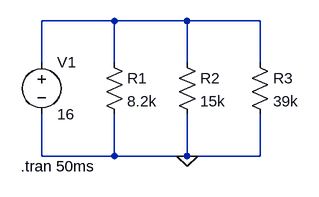
[diagram p0: schematic Draft3.asc]
Draft3.asc, the LTspice schematic file:
Version 4
SHEET 1 880 680
WIRE 112 80 0 80
WIRE 224 80 112 80
WIRE 336 80 224 80
WIRE 0 144 0 80
WIRE 112 144 112 80
WIRE 224 144 224 80
WIRE 336 144 336 80
WIRE 0 288 0 224
WIRE 112 288 112 224
WIRE 112 288 0 288
WIRE 224 288 224 224
WIRE 224 288 112 288
WIRE 336 288 336 224
WIRE 336 288 224 288
FLAG 224 288 0
SYMBOL res 96 128 R0
SYMATTR InstName R1
SYMATTR Value 8.2k
SYMBOL res 208 128 R0
SYMATTR InstName R2
SYMATTR Value 15k
SYMBOL res 320 128 R0
SYMATTR InstName R3
SYMATTR Value 39k
SYMBOL voltage 0 128 R0
WINDOW 123 0 0 Left 0
WINDOW 39 0 0 Left 0
SYMATTR InstName V1
SYMATTR Value 16
TEXT -32 304 Left 2 !.tran 50ms

The netlist it stands for:
* Draft3.asc
R1 N001 0 8.2k
R2 N001 0 15k
R3 N001 0 39k
V1 N001 0 16
.tran 50ms
.backanno
.end

* Results of the author's LTspice run, read from the files saved beside the schematic
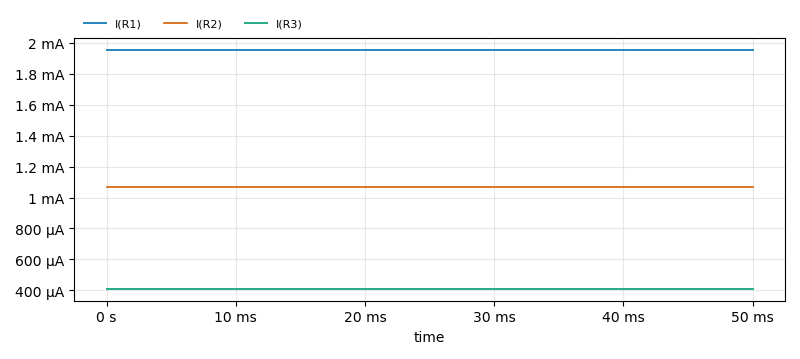
[diagram p1: Transient Analysis of Draft3.asc, plotted from the saved traces]
* Transient Analysis, 1 run:
*   I(R1): min 1.951 mA, max 1.951 mA, average 1.951 mA, rms 1.951 mA, last 1.951 mA
*   I(R2): min 1.067 mA, max 1.067 mA, average 1.067 mA, rms 1.067 mA, last 1.067 mA
*   I(R3): min 410.3 µA, max 410.3 µA, average 410.3 µA, rms 410.3 µA, last 410.3 µA